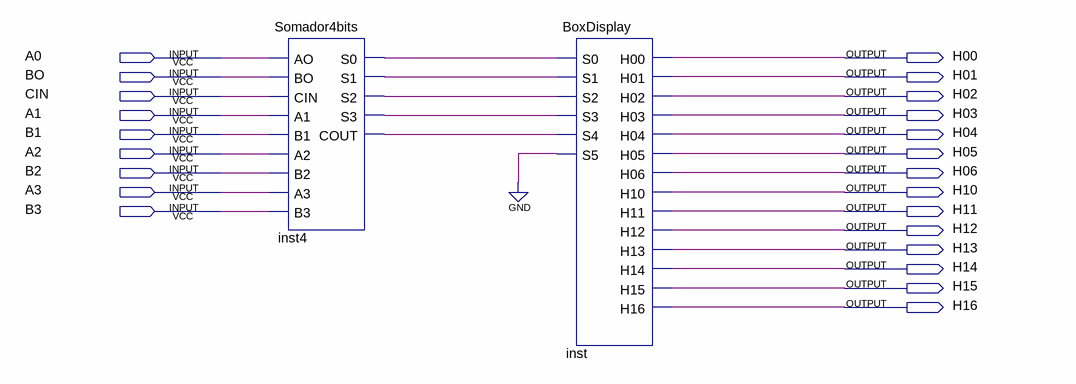
[diagram p0: schematic sheet]
// Quartus schematic 5bit.bdf as structural Verilog: 2 symbols, 23 pins
module \5bit  (
  input  A0,
  input  BO,
  input  CIN,
  input  A1,
  input  B1,
  input  A2,
  input  B2,
  input  A3,
  input  B3,
  output H00,
  output H01,
  output H02,
  output H03,
  output H04,
  output H05,
  output H06,
  output H10,
  output H11,
  output H12,
  output H13,
  output H14,
  output H15,
  output H16
);

  wire inst4_cout, inst4_s0, inst4_s1, inst4_s2, inst4_s3;

  Somador4bits inst4 (
    .AO(A0), .BO(BO), .CIN(CIN), .A1(A1), .B1(B1), .A2(A2), .B2(B2), .A3(A3), .B3(B3), .S0(inst4_s0),
    .S1(inst4_s1), .S2(inst4_s2), .S3(inst4_s3), .COUT(inst4_cout));
  BoxDisplay inst (
    .S0(inst4_s0), .S1(inst4_s1), .S2(inst4_s2), .S3(inst4_s3), .S4(inst4_cout), .S5(1'b0), .H00(H00),
    .H01(H01), .H02(H02), .H03(H03), .H04(H04), .H05(H05), .H06(H06), .H10(H10), .H11(H11), .H12(H12),
    .H13(H13), .H14(H14), .H15(H15), .H16(H16));
endmodule
